# EasyEDA Pro project 光流原理图与PCB整体.epro

# Schematic Schematic1
Assembly Variant: Basic; Board Name: Board1; Create Date: 2025-11-28; Page Name: P1; Project Name: 光流激光一体_2025-11-28_00-36-02; Schematic Name: Schematic1; Update Date: 2025-11-28; BladeWidth: 10; Company: 嘉立创EDA; Page Size: A4; RegionStart: 1; ShowBorder: 1; TitleBlock: 1; TitleBlockPosition: 3; Version: V1.0; XRegionCount: 6; YRegionCount: 4
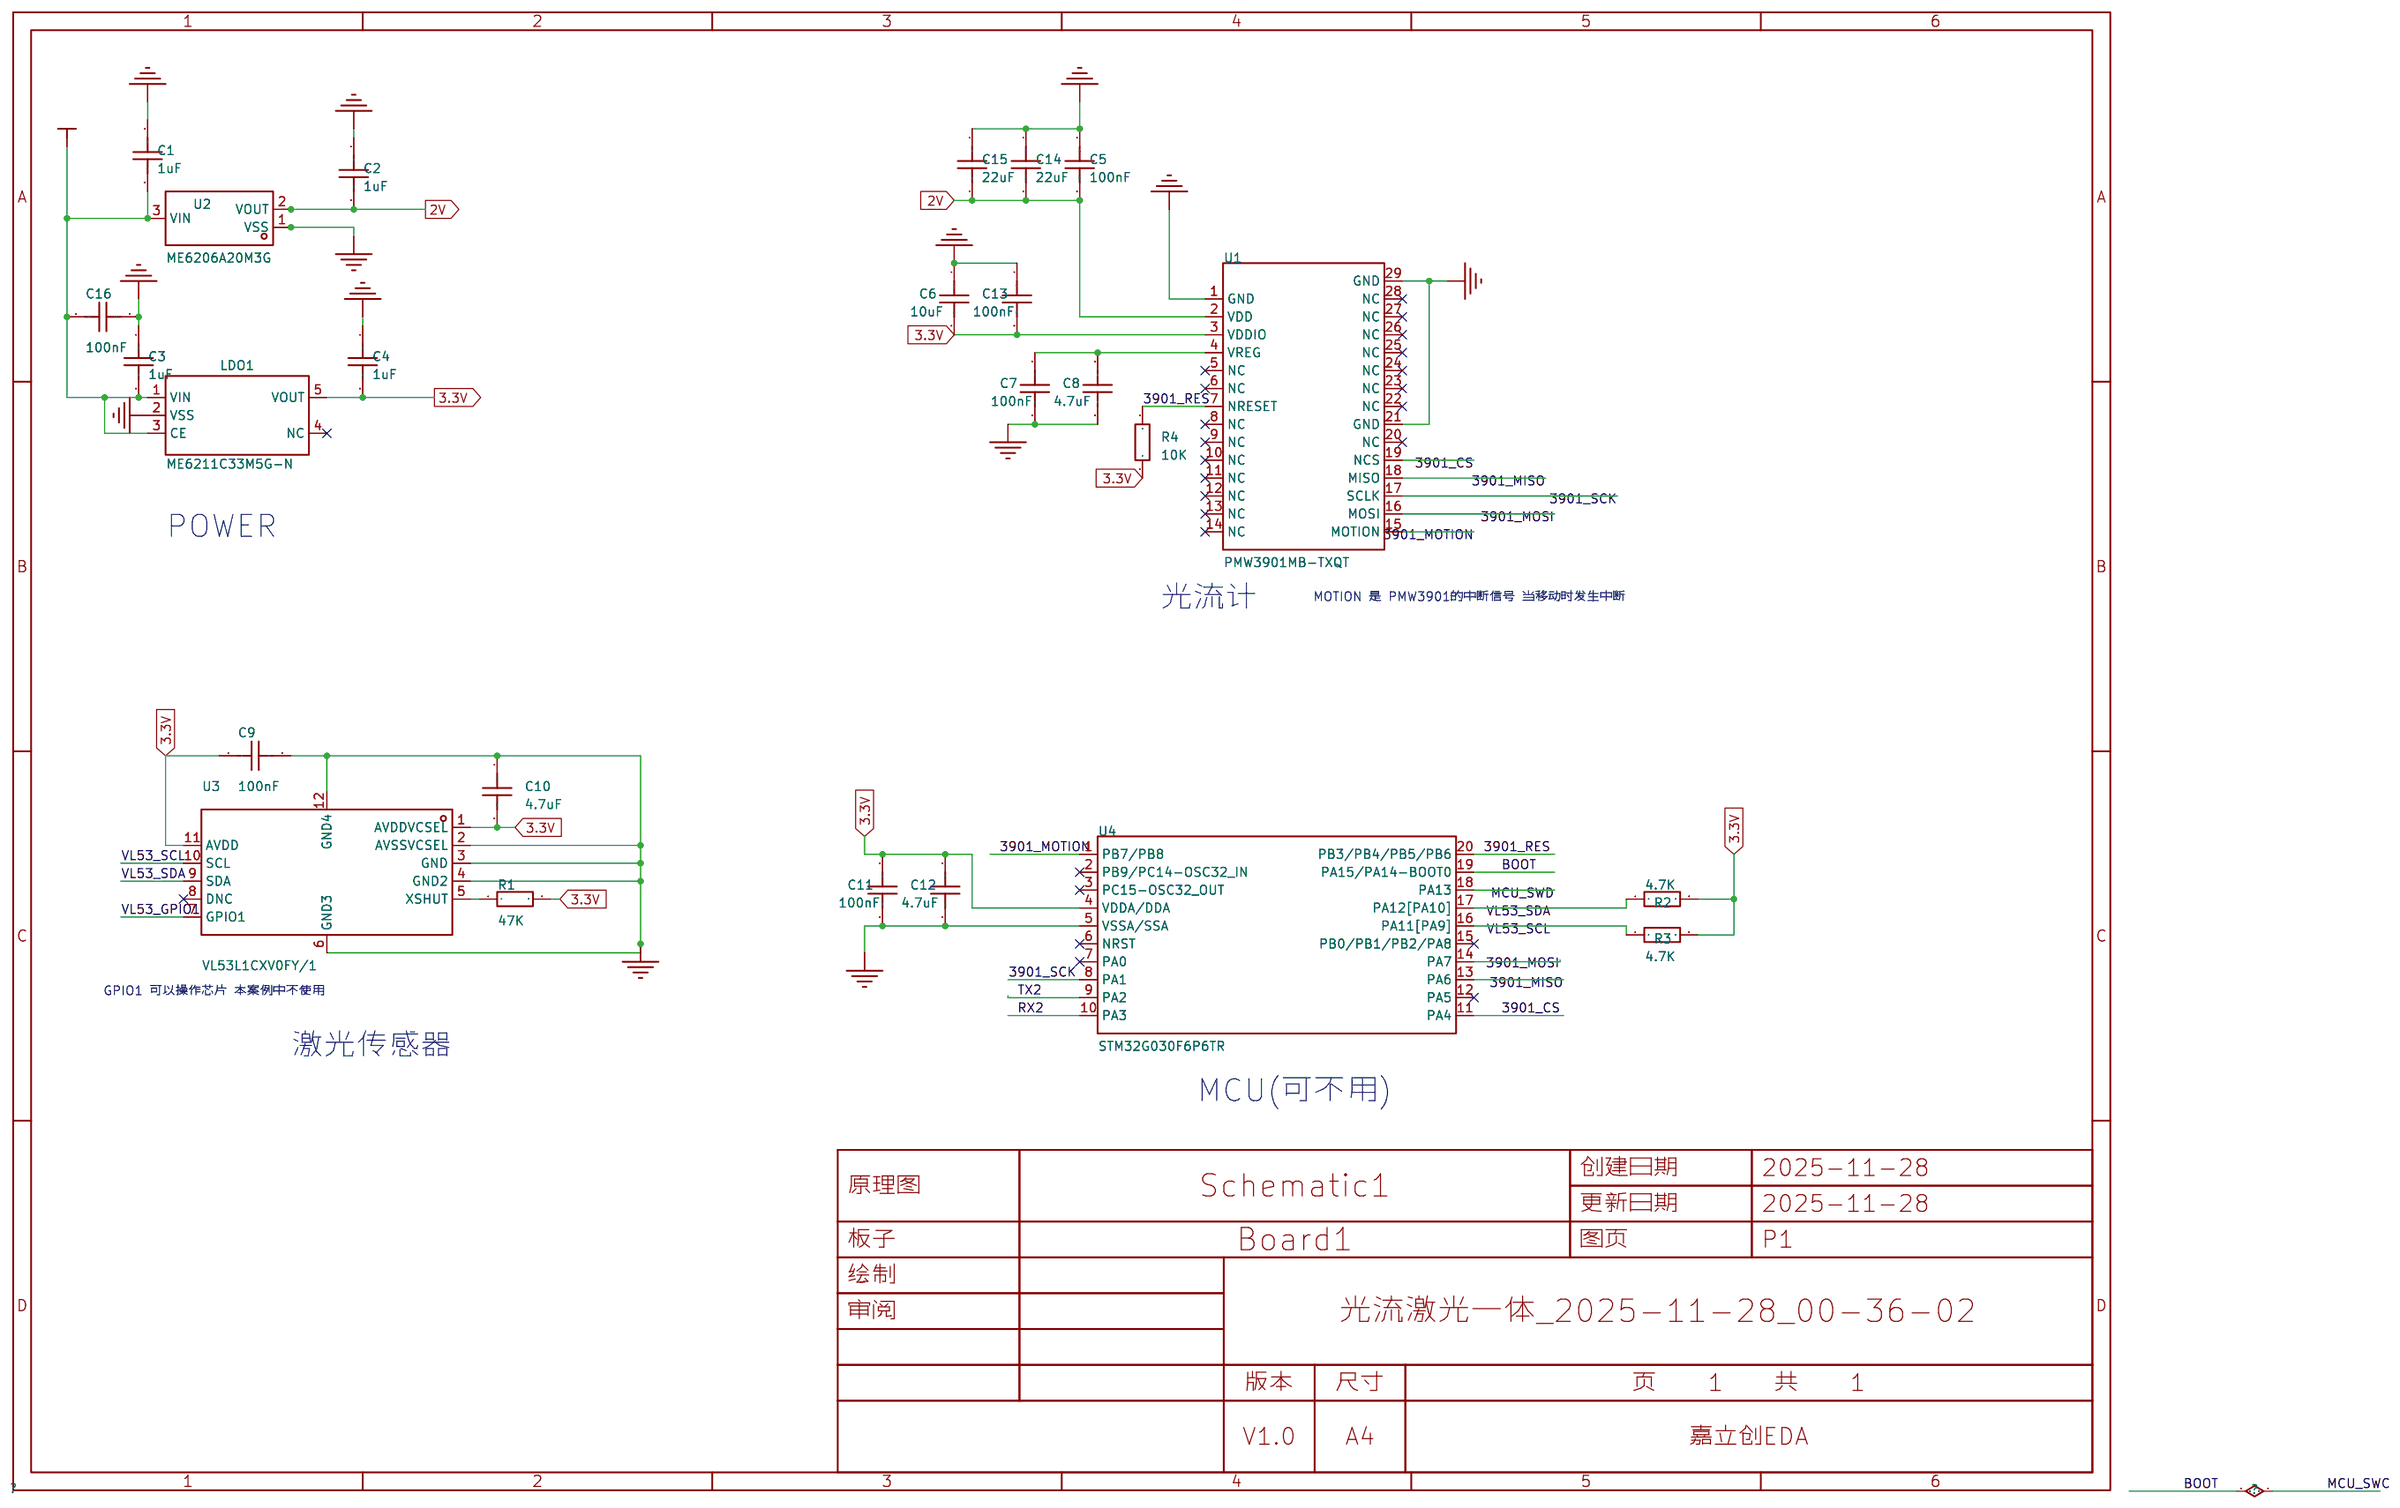
[diagram p0: schematic sheet]

## Parts
C1  1uF  [C0603]
C2  1uF  [C0603]
C3  1uF  [C0603]
C4  1uF  [C0603]
C5  100nF  [C0603]
C6  10uF  [C0603]
C7  100nF  [C0603]
C8  4.7uF  [C0603]
C9  100nF  [C0603]
C10  4.7uF  [C0603]
C11  100nF  [C0603]
C12  4.7uF  [C0603]
C13  100nF  [C0603]
C14  22uF  [C0603]
C15  22uF  [C0603]
C16  100nF  [C0603]
LDO1  ME6211C33M5G-N  [SOT-23-5_L3.0-W1.7-P0.95-LS2.8-BL]
R1  47K  [R0603]
R2  4.7K  [R0603]
R3  4.7K  [R0603]
R4  10K  [R0603]
U1  PMW3901MB-TXQT  [COB-28_L6.0-W6.0-P0.65-TL-EP]
U2  ME6206A20M3G  [SOT-23-3_L3.0-W1.7-P0.95-LS2.9-BR]
U3  VL53L1CXV0FY/1  [OPTO-SMD_VL53L1CXV0FY-1]
U4  STM32G030F6P6TR  [TSSOP-20_L6.5-W4.4-P0.65-LS6.4-BL]

## Library data of the parts
C1-C16 = CAP_0603: Supplier Footprint: 0603
LDO1 = ME6211C33M5G-N: 输出类型:固定;工作电压:6V;输出电压:3.3V;输出电流:500mA;电源纹波抑制比(PSRR):70dB@(1kHz);输出极性:正极;; LCSC Part Name: 输入6V 输出3.3V 500mA; Supplier Part: C82942; Manufacturer: MICRONE(南京微盟); Supplier Footprint: SOT-23-5; JLCPCB Part Class: Extended Part; Datasheet: https://item.szlcsc.com/datasheet/ME6211C33M5G-N/84106.html; Supplier: LCSC; Output Type: 固定; Voltage - Supply: 6V; Output Voltage: 3.3V; Output Current: 500mA; Power Supply Rejection Ratio (PSRR): 70dB@(1kHz); Voltage Dropout: 120mV@(100mA); standby current: 60uA; Noise: 50uVrms; Features: 过流保护；带使能；短路保护; Operating Temperature: -40℃~+150℃; Output Configuration: 正极; Number of Outputs: 1
R1-R4 = Res_0603: Supplier Footprint: 0603
U1 = PMW3901MB-TXQT_C43496881: LCSC Part Name: 2件套 PMW3901MB-TXQT; Supplier Part: C43496881; Manufacturer: PixArt (原相科技); Supplier Footprint: COB-28; JLCPCB Part Class: Extended Part; Datasheet: https://item.szlcsc.com/datasheet/PMW3901MB-TXQT/45590711.html; Supplier: LCSC
U2 = ME6206A20M3G: 输出类型:固定;工作电压:6V;输出电压:2V;输出电流:-;电源纹波抑制比(PSRR):45dB@(1kHz);输出极性:正极;; LCSC Part Name: 输入6V 输出2V; Supplier Part: C128056; Manufacturer: MICRONE(南京微盟); Supplier Footprint: SOT-23; JLCPCB Part Class: Extended Part; Datasheet: https://item.szlcsc.com/datasheet/ME6206A20M3G/139341.html; Supplier: LCSC; Output Type: 固定; Voltage - Supply: 6V; Output Voltage: 2V; Power Supply Rejection Ratio (PSRR): 45dB@(1kHz); Features: 短路保护；过流保护; Operating Temperature: -25℃~+125℃@(Ta); Output Configuration: 正极; Number of Outputs: 1
U3 = VL53L1CXV0FY/1: 线性范围:4m;; Supplier Part: C190004; Manufacturer: ST(意法半导体); Supplier Footprint: LGA-12(2.5x4.9); JLCPCB Part Class: Extended Part; Datasheet: https://atta.szlcsc.com/upload/public/pdf/source/20180403/C190004_0741FA17F5A8F41A8273E0771692B843.pdf; Supplier: LCSC; Supply Voltage: 2.6V~3.5V; Iinearity Range: 4m
U4 = STM32G030F6P6TR: CPU内核:-;CPU最大主频:64MHz;; LCSC Part Name: 主流超值系列Arm Cortex-M0+ MCU，具有32 KB Flash存储器、8 KB RAM、64 MHz CPU、2x USART、定时器、ADC和通信接口，2-3.6V; Supplier Part: C529330; Manufacturer: ST(意法半导体); Supplier Footprint: TSSOP-20; JLCPCB Part Class: Extended Part; Datasheet: https://item.szlcsc.com/datasheet/STM32G030F6P6TR/549608.html; Supplier: LCSC; CPU Maximum Speed: 64MHz; Program Storage Size: 32KB; Program Memory Type: FLASH; Number of I/O: 17; ADC (Bit): 12bit; Voltage - Supply: 2V~3.6V

## Nets
2V: C2.2 C5.2 C14.2 C15.2 U1.2(VDD) U2.2(VOUT)
3.3V: C4.2 C6.2 C9.1 C10.2 C11.1 C12.1 C13.2 LDO1.5(VOUT) R1.2 R2.2 R3.2 R4.1 U1.3(VDDIO) U3.1(AVDDVCSEL) U3.11(AVDD) U4.4(VDDA/DDA)
+5V: C1.2 C3.2 C16.1 LDO1.1(VIN) LDO1.3(CE) U2.3(VIN)
GND: C1.1 C2.1 C3.1 C4.1 C5.1 C6.1 C7.2 C8.2 C9.2 C10.1 C11.2 C12.2 C13.1 C14.1 C15.1 C16.2 LDO1.2(VSS) U1.1(GND) U1.21(GND) U1.29(GND) U2.1(VSS) U3.2(AVSSVCSEL) U3.3(GND) U3.4(GND2) U3.6(GND3) U3.12(GND4) U4.5(VSSA/SSA)
3901_CS: U1.19(NCS) U4.11(PA4)
3901_MISO: U1.18(MISO) U4.13(PA6)
3901_MOSI: U1.16(MOSI) U4.14(PA7)
3901_MOTION: U1.15(MOTION) U4.1(PB7/PB8)
3901_RES: R4.2 U1.7(NRESET) U4.20(PB3/PB4/PB5/PB6)
3901_SCK: U1.17(SCLK) U4.8(PA1)
BOOT: U4.19(PA15/PA14-BOOT0)
MCU_SWD: U4.18(PA13)
RX2: U4.10(PA3)
TX2: U4.9(PA2)
VL53_GPIO1: U3.7(GPIO1)
VL53_SCL: R3.1 U3.10(SCL) U4.16(PA11[PA9])
VL53_SDA: R2.1 U3.9(SDA) U4.17(PA12[PA10])
$1N23: C7.1 C8.1 U1.4(VREG)
$1N33: R1.1 U3.5(XSHUT)

Not connected (* = marked no-connect by the designer): LDO1 4(NC)*; U1 5(NC)* 6(NC)* 8(NC)* 9(NC)* 10(NC)* 11(NC)* 12(NC)* 13(NC)* 14(NC)* 20(NC)* 22(NC)* 23(NC)* 24(NC)* 25(NC)* 26(NC)* 27(NC)* 28(NC)*; U3 8(DNC)*; U4 2(PB9/PC14-OSC32_IN)* 3(PC15-OSC32_OUT)* 6(NRST)* 7(PA0)* 12(PA5)* 15(PB0/PB1/PB2/PA8)*

## Notes on the sheet
- POWER
- 光流计
- MOTION 是 PMW3901的中断信号 当移动时发生中断
- GPIO1 可以操作芯片 本案例中不使用
- 激光传感器
- MCU(可不用)

# Board PCB1
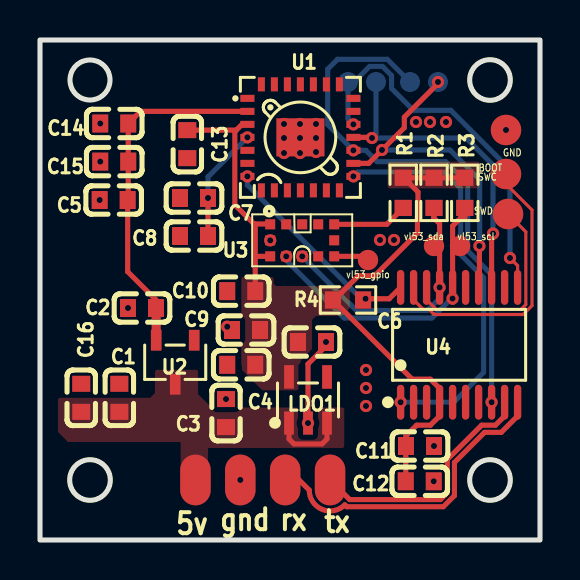
[diagram p1: board, top side]
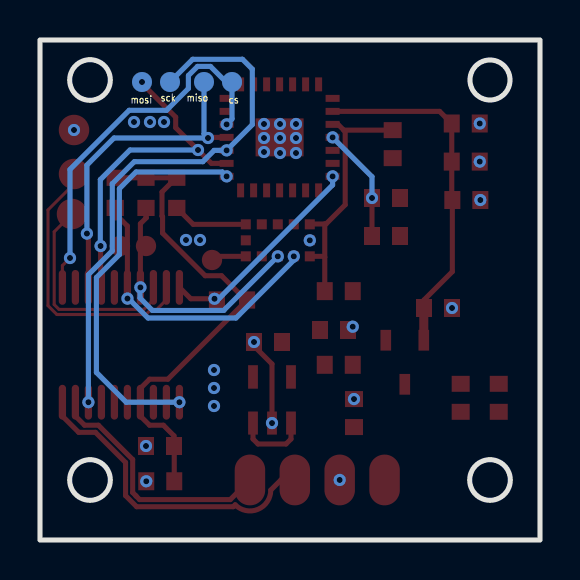
[diagram p2: board, bottom side, seen from below]

Outline 25 x 25 mm; copper layers: Top Layer, Bottom Layer. Coordinates in mm from the lower left corner of the outline.
Outline path: rectangle 0,25 25,0 ; circle c2.5,23 r1 ; circle c2.5,3 r1.02 ; circle c22.5,23 r1.02 ; circle c22.5,3 r1.02
Stack: Top Layer 0.035mm / Dielectric1 1.51mm FR4 er 4.5 / Bottom Layer 0.035mm

## Design rules (mm)
spacing copperThickness1oz (default): track to track 0.102, other pairs 0.152 to 0.3
spacing copperThickness2oz: track to track 0.203, other pairs 0.152 to 0.3
track width copperThickness1oz (default): min 0.127, default 0.254, max 2.54
track width copperThickness2oz: min 0.203, default 0.254, max 2.54
differential pair differentialPair (default): width min 0.127, default 0.254, max 2.54; gap min 0.152, default 0.152
net GND uses copperRegion_copperThickness1oz
net +5V uses copperRegion_copperThickness1oz
pour e160 uses copperRegion_default, default
net 3.3V uses copperRegion_copperThickness1oz

## Placement (name value [footprint] x y rotation side)
C1  1uF  [C0603]  3.97 7.11 270 top
C2  1uF  [C0603]  5.1 11.6 0 top
C3  1uF  [C0603]  9.3 6.35 270 top
C4  1uF  [C0603]  10.06 8.76 0 top
C5  100nF  [C0603]  3.68 17 0 top
C6  10uF  [C0603]  13.6 9.9 180 top
C7  100nF  [C0603]  7.7 17.1 180 top
C8  4.7uF  [C0603]  7.7 15.2 180 top
C9  100nF  [C0603]  10.3 10.5 180 top
C10  4.7uF  [C0603]  10.06 12.44 0 top
C11  100nF  [C0603]  19 4.7 0 top
C12  4.7uF  [C0603]  18.99 2.94 0 top
C13  100nF  [C0603]  7.37 19.79 90 top
C14  22uF  [C0603]  3.71 20.83 0 top
C15  22uF  [C0603]  3.71 18.92 0 top
C16  100nF  [C0603]  2.06 7.11 90 top
LDO1  ME6211C33M5G-N  [SOT-23-5_L3.0-W1.7-P0.95-LS2.8-BL]  13.4 7 0 top
NOREF  -  [Pad_e150]  16.4 14 90 top
NOREF#2  -  [Pad_e135]  23.3 20.5 0 top
NOREF#3  -  [Pad_e245]  18.5 22.9 0 top
NOREF#4  -  [Pad_e226]  23.4 16.3 0 top
NOREF#5  -  [Pad_e138]  10.02 3 0 top
NOREF#6  -  [Pad_e246]  15.4 22.9 0 top
NOREF#7  -  [Pad_e244]  19.9 22.9 0 top
NOREF#8  -  [Pad_e140]  12.26 3 0 top
NOREF#9  -  [Pad_e1]  21 14.7 90 top
NOREF#10  -  [Pad_e147]  19.7 14.7 90 top
NOREF#11  -  [Pad_e243]  16.8 22.9 0 top
NOREF#12  -  [Pad_e137]  7.77 3 0 top
NOREF#13  -  [Pad_e139]  14.5 3 0 top
NOREF#14  -  [Pad_e136]  23.3 18.3 0 top
R1  47K  [R0603]  18.16 17.36 90 top
R2  4.7K  [R0603]  19.7 17.36 90 top
R3  4.7K  [R0603]  21.24 17.36 90 top
R4  10K  [R0603]  15.4 12 0 top
U1  PMW3901MB-TXQT  [COB-28_L6.0-W6.0-P0.65-TL-EP]  13.02 20.13 0 top
U2  ME6206A20M3G  [SOT-23-3_L3.0-W1.7-P0.95-LS2.9-BR]  6.76 8.89 90 top
U3  VL53L1CXV0FY/1  [OPTO-SMD_VL53L1CXV0FY-1]  13.11 14.98 180 top
U4  STM32G030F6P6TR  [TSSOP-20_L6.5-W4.4-P0.65-LS6.4-BL]  20.96 9.76 0 top

## Footprints (pads in the part's own frame, mm; a bottom-side part is the same pattern mirrored in y, then rotated)
C0603
  rect 0.8x0.9 smd: 1(-0.7,0) 2(0.7,0)
COB-28_L6.0-W6.0-P0.65-TL-EP
  rect 0.7x0.35 smd: 1(-2.65,1.95) 2(-2.65,1.3) 3(-2.65,0.65) 4(-2.65,0) 5(-2.65,-0.65) 6(-2.65,-1.3) 7(-2.65,-1.95) 15(2.65,-1.95) 16(2.65,-1.3) 17(2.65,-0.65) 18(2.65,0) 19(2.65,0.65) 20(2.65,1.3) 21(2.65,1.95)
  rect 0.35x0.7 smd: 8(-1.95,-2.65) 9(-1.3,-2.65) 10(-0.65,-2.65) 11(0,-2.65) 12(0.65,-2.65) 13(1.3,-2.65) 14(1.95,-2.65) 22(1.95,2.65) 23(1.3,2.65) 24(0.65,2.65) 25(0,2.65) 26(-0.65,2.65) 27(-1.3,2.65) 28(-1.95,2.65)
  rect 2.4x1.9 smd: 29(0,0)
OPTO-SMD_VL53L1CXV0FY-1
  rect 0.5x0.5 smd: 1(1.6,-0.8) 2(0.8,-0.8) 3(0,-0.8) 4(-0.8,-0.8) 5(-1.6,-0.8) 6(-1.6,0) 7(-1.6,0.8) 8(-0.8,0.8) 9(0,0.8) 10(0.8,0.8) 11(1.6,0.8) 12(1.6,0)
Pad_e1
  round 1.016 smd: 1(0,0)
Pad_e135
  round 1.524 smd: 1(0,0)
Pad_e136
  round 1.524 smd: 1(0,0)
Pad_e137
  oval 1.524x2.54 smd: 1(0,0)
Pad_e138
  oval 1.524x2.54 smd: 1(0,0)
Pad_e139
  oval 1.524x2.54 smd: 1(0,0)
Pad_e140
  oval 1.524x2.54 smd: 1(0,0)
Pad_e147
  round 1.016 smd: 1(0,0)
Pad_e150
  round 1.016 smd: 1(0,0)
Pad_e226
  round 1.524 smd: 1(0,0)
Pad_e243
  round 1 smd far side: 1(0,0)
Pad_e244
  round 1 smd far side: 1(0,0)
Pad_e245
  round 1 smd far side: 1(0,0)
Pad_e246
  round 1 smd far side: 1(0,0)
R0603
  rect 0.806x0.864 smd: 1(-0.753,0) 2(0.753,0)
SOT-23-3_L3.0-W1.7-P0.95-LS2.9-BR
  rect 1.038x0.532 smd: 1(1.101,-0.95) 2(1.101,0.95) 3(-1.101,0)
SOT-23-5_L3.0-W1.7-P0.95-LS2.8-BL
  rect 0.49x1.157 smd: 1(-0.95,-1.153) 2(0,-1.153) 3(0.95,-1.153)
  rect 0.49x1.175 smd: 4(0.95,1.153) 5(-0.95,1.153)
TSSOP-20_L6.5-W4.4-P0.65-LS6.4-BL
  oval 0.364x1.742 smd: 1(-2.925,-2.871) 2(-2.275,-2.871) 3(-1.625,-2.871) 4(-0.975,-2.871) 5(-0.325,-2.871) 6(0.325,-2.871) 7(0.975,-2.871) 8(1.625,-2.871) 9(2.275,-2.871) 10(2.925,-2.871) 11(2.925,2.871) 12(2.275,2.871) 13(1.625,2.871) 14(0.975,2.871) 15(0.325,2.871) 16(-0.325,2.871) 17(-0.975,2.871) 18(-1.625,2.871) 19(-2.275,2.871) 20(-2.925,2.871)

## Nets
2V: C2.2 C5.2 C14.2 C15.2 U1.2 U2.2
3.3V: C4.2 C6.2 C9.1 C10.2 C11.1 C12.1 C13.2 LDO1.5 R1.2 R2.2 R3.2 R4.1 U1.3 U3.1 U3.11 U4.4
+5V: C1.2 C3.2 C16.1 LDO1.1 LDO1.3 NOREF#12.1 U2.3
GND: C1.1 C2.1 C3.1 C4.1 C5.1 C6.1 C7.2 C8.2 C9.2 C10.1 C11.2 C12.2 C13.1 C14.1 C15.1 C16.2 LDO1.2 NOREF#2.1 NOREF#5.1 U1.1 U1.21 U1.29 U2.1 U3.2 U3.3 U3.4 U3.6 U3.12 U4.5
3901_CS: NOREF#6.1 U1.19 U4.11
3901_MISO: NOREF#11.1 U1.18 U4.13
3901_MOSI: NOREF#7.1 U1.16 U4.14
3901_MOTION: U1.15 U4.1
3901_RES: R4.2 U1.7 U4.20
3901_SCK: NOREF#3.1 U1.17 U4.8
BOOT: NOREF#14.1 U4.19
MCU_SWD: NOREF#4.1 U4.18
RX2: NOREF#8.1 U4.10
TX2: NOREF#13.1 U4.9
VL53_GPIO1: NOREF.1 U3.7
VL53_SCL: NOREF#9.1 R3.1 U3.10 U4.16
VL53_SDA: NOREF#10.1 R2.1 U3.9 U4.17
$1N23: C7.1 C8.1 U1.4
$1N33: R1.1 U3.5

Pads without a net: LDO1 4; U1 5 6 8 9 10 11 12 13 14 20 22 23 24 25 26 27 28; U3 8; U4 2 3 6 7 12 15

## Via types
v1: diameter 0.61, hole 0.305, Top Layer to Bottom Layer, 49 vias

## Routing (per net, layer and track width the routed paths; a pad name or vN(x,y) marks a point on that pad's centre or on a via; arc(x,y) is an arc through that point)
2V: length 17.6
  Top Layer w0.254: U1.2 5.02,21.43 C14.2 C15.2 4.41,17.03 4.38,17 4.38,13.42 5.8,12 C2.2
  Top Layer w0.454: C2.2 5.81,11.59 U2.2
3.3V: length 37.9
  Top Layer w0.254: 7.37,20.49 9.81,20.49 ; 9.81,20.49 9.74,20.42 9.74,16.76 10.7,15.8 10.76,15.8 ; 9.81,20.49 10.12,20.8 10.35,20.8 U1.3 ; 10.76,14.14 10.76,15.8 ; 10.76,14.14 C10.2 ; 10.76,14.14 10.81,14.18 U3.11 ; 10.76,15.8 11.49,15.8 U3.1 ; R4.1 14.68,11.97 ; 14.68,11.97 18.61,8.04 19.52,8.04 19.98,7.58 19.98,6.2 19.52,5.74 18.83,5.74 18.3,5.21 C11.1 18.29,4.69 C12.1 ; 14.68,11.97 15.92,13.21 16.74,13.21 18.87,15.35 18.87,16.16 18.9,16.19 18.9,17.4 18.19,18.11 ; R3.2 R2.2 18.19,18.11 ; 18.19,18.11 R1.2
+5V: length 3.7
  Top Layer w0.254: LDO1.1 12.45,5.05 12.7,4.8 14.1,4.8 14.35,5.05 LDO1.3
GND: length 4.4
  Top Layer w0.254: v1(14.3,9.9) 14.3,9.7 13.4,8.8 v1(13.4,5.85)
  vias: v1(3.01,20.83) v1(3.01,18.92) v1(2.98,17) v1(4.4,11.6) v1(9.3,7.05) v1(9.36,10.67) v1(10.02,3) v1(11.51,14.98) v1(12.2,20.8) v1(12.2,20.1) v1(12.2,19.35) v1(13,20.8) v1(13,20.1) v1(13,19.35) v1(13.8,20.8) v1(13.8,20.1) v1(13.8,19.4) v1(16.3,8.5) v1(16.3,7.6) v1(16.3,6.7) v1(17,15) v1(17.7,15) v1(18.8,20.9) v1(19.5,20.9) v1(19.7,4.7) v1(19.69,2.94) v1(20.3,20.9) v1(23.3,20.5)
3901_CS: length 19.2
  Top Layer w0.154: U4.11 23.88,13.72 v1(23.5,14.1)
  Bottom Layer w0.254: v1(23.5,14.1) 23.5,18.53 20.54,21.48 18.67,21.48 17.58,22.58 17.58,23.22 17.12,23.68 16.48,23.68 15.7,22.9 NOREF#6.1 15.4,21.05 v1(15.67,20.78)
3901_MISO: length 16.6
  Top Layer w0.254: v1(22.65,15.32) 22.58,15.25 U4.13 ; v1(16.6,20.1) 16.57,20.13 U1.18
  Bottom Layer w0.254: v1(22.65,15.32) 22.65,18.75 21.3,20.1 v1(16.6,20.1) 16.8,20.3 NOREF#11.1
3901_MOSI: length 17.2
  Top Layer w0.254: U1.16 16.43,18.83 v1(17.1,19.5) 18.22,20.62 18.22,21.14 19.9,22.83 v1(19.9,22.9) ; v1(21.97,14.7) 21.97,12.67 U4.14
  Bottom Layer w0.254: v1(21.97,14.7) 21.98,14.71 21.98,18.02 20.5,19.5 v1(17.1,19.5)
3901_MOTION: length 20.2
  Bottom Layer w0.254: v1(15.67,18.18) 15.89,18.4 20.2,18.4 21.03,17.57 21.03,14.27 22.18,13.12 22.18,8.38 20.69,6.89 v1(18.03,6.89)
3901_RES: length 10.7
  Top Layer w0.254: U4.20 17.46,12.06 v1(16.28,12.06)
  Bottom Layer w0.254: v1(10.37,18.18) 10.37,17.75 16.06,12.06 v1(16.28,12.06)
3901_SCK: length 27.2
  Bottom Layer w0.254: NOREF#3.1 17.37,24.03 14.88,24.03 14.38,23.54 14.38,20.77 v1(15.67,19.48) 16.29,19.48 16.86,18.92 20.28,18.92 21.39,17.81 21.39,14.46 22.58,13.27 v1(22.58,6.89)
BOOT: length 14.1
  Top Layer w0.154: U4.19 18.68,12.01 19.16,11.53 19.45,11.53 19.7,11.28 24.16,11.28 24.6,11.72 24.6,16.5 23.3,17.8 NOREF#14.1
MCU_SWD: length 10.8
  Top Layer w0.154: NOREF#4.1 24.29,15.41 24.29,11.77 24.05,11.53 19.81,11.53 19.33,12.01 19.33,12.63
RX2: length 16.1
  Top Layer w0.254: 23.88,6.89 23.88,6.2 23.06,5.38 22.23,5.38 20.72,3.88 20.72,2.22 20.17,1.66 15.34,1.66 15.24,1.76 arc(14.11,1.53) 13.46,2.49 12.95,3 NOREF#8.1
TX2: length 12.5
  Top Layer w0.254: 23.23,6.89 23.23,6.2 22.77,5.74 22.08,5.74 20.37,4.03 20.37,2.37 20.2,2.2 20.2,2.2 20.02,2.02 15.48,2.02 NOREF#13.1
VL53_GPIO1: length 1.8
  Top Layer w0.254: U3.7 16.41,14.18 16.51,14.08
VL53_SCL: length 14.4
  Top Layer w0.254: R3.1 21.24,16.14 21.21,16.11 21.04,16.11 20.63,15.7 U4.16
  Bottom Layer w0.254: v1(12.31,14.18) 12.31,13.99 15.2,11.1 19.6,11.1 20.57,12.07 v1(20.63,12.07)
VL53_SDA: length 12.9
  Top Layer w0.254: v1(19.98,12.63) 19.98,15.81 19.69,16.11 19.7,16.12 R2.1
  Bottom Layer w0.254: v1(13.11,14.18) 15.82,11.48 19.38,11.48 20,12.1 20,12.6
$1N23: length 5.7
  Top Layer w0.254: v1(8.4,17.1) C8.1
  Bottom Layer w0.254: v1(10.37,20.13) 8.4,18.16 v1(8.4,17.1)
$1N33: length 3.8
  Top Layer w0.254: R1.1 17.34,15.78 U3.5

## Copper pours and planes (outline as drawn; the poured copper is in the pictures)
3.3V on Top Layer: 10.06,13.15 11.68,13.15 11.68,12.82 11.8,12.7 15.29,12.7 15.52,12.46 15.52,11.62 15.1,11.2 13.8,11.2 13.6,11 13.6,9.43 12.92,8.75 12.92,7.48 11.12,7.48 10.1,8.5 10.1,8.7 10.06,8.74
3.3V on Top Layer: 17.38,18.92 21.98,18.92 21.98,17.58 17.38,17.58
+5V on Top Layer: 0.94,7.11 5.51,7.11 5.75,7.35 5.75,8.51 7.9,8.51 7.9,7.3 8.57,6.63 15.21,6.63 15.21,4.6 8.4,4.6 8.4,2.4 8.5,2.3 7.13,2.3 7.03,2.4 7.03,4.87 7,4.9 1.4,4.9 0.9,5.4 0.9,7.07

## Text on the board
Bottom Silkscreen Layer: cs | miso | sck | mosi
Top Silkscreen Layer: vl53_gpio | vl53_sda | vl53_scl | SWD | SWC | BOOT | GND | 5v | gnd | rx | tx
